# Altium schematic sheet Bridge.SchDoc
size A4
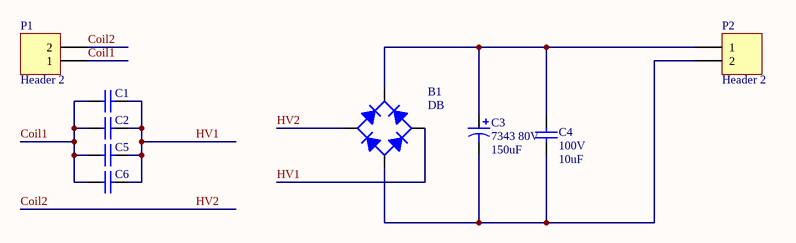
[diagram p0: Bridge.SchDoc]

## Parts
B1  DB  [GBU]
C1  Cap  [C1206]  (value not drawn)
C2  Cap  [C1206]  (value not drawn)
C3  7343 80V  value 150uF  [CAP-SMD_BD12.5-L13.0-W13.0-FD]
C4  100V  value 10uF  [C2220]
C5  Cap  [C1206]  (value not drawn)
C6  Cap  [C1206]  (value not drawn)
P1  Header 2  [2PIN-5.08B]
P2  Header 2  [2PIN-5.08B]

## Nets
Coil1: C1.2 C2.2 C5.2 C6.2 P1.1
Coil2: B1.AC1 P1.2  [also labelled HV2]
HV1: B1.AC2 C1.1 C2.1 C5.1 C6.1
NetB1_DC+: B1.DC+ C3.1 C4.2 P2.1
NetB1_DC-: B1.DC- C3.2 C4.1 P2.2

## Library data of the parts
B1 = DB: 整流桥; 版权归属: 封装库来自淘宝卖家 ID：黄晶宝石; BOM名称: 整流桥; 学习资源: https://shop463601444.taobao.com
C1 C2 C5 C6 = Cap: Capacitor; Value: 100pF; Published: 8-Jun-2000; LatestRevisionDate: 17-Jul-2002; LatestRevisionNote: Re-released for DXP Platform.; PackageReference: RAD-0.3; Publisher: Altium Limited; PackageDescription: Radial Cap, Thru-Hole; 2 Leads; 0.3 in Pin Spacing
C3 = Cap Pol1: Polarized Capacitor (Radial); Published: 8-Jun-2000; LatestRevisionDate: 17-Jul-2002; LatestRevisionNote: Re-released for DXP Platform.; PackageReference: RB7.6-15; Publisher: Altium Limited; PackageDescription: Polarized Capacitor (Radial); 2 Leads
C4 = Cap: Capacitor; Published: 8-Jun-2000; LatestRevisionDate: 17-Jul-2002; LatestRevisionNote: Re-released for DXP Platform.; PackageReference: RAD-0.3; Publisher: Altium Limited; PackageDescription: Radial Cap, Thru-Hole; 2 Leads; 0.3 in Pin Spacing
P1 P2 = Header 2: Header, 2-Pin; LatestRevisionDate: 17-Jul-2002; LatestRevisionNote: Re-released for DXP Platform.; Publisher: Altium Limited